# EAGLE schematic ALU (EAGLE 9.6.2)

## Sheet 1 of 3
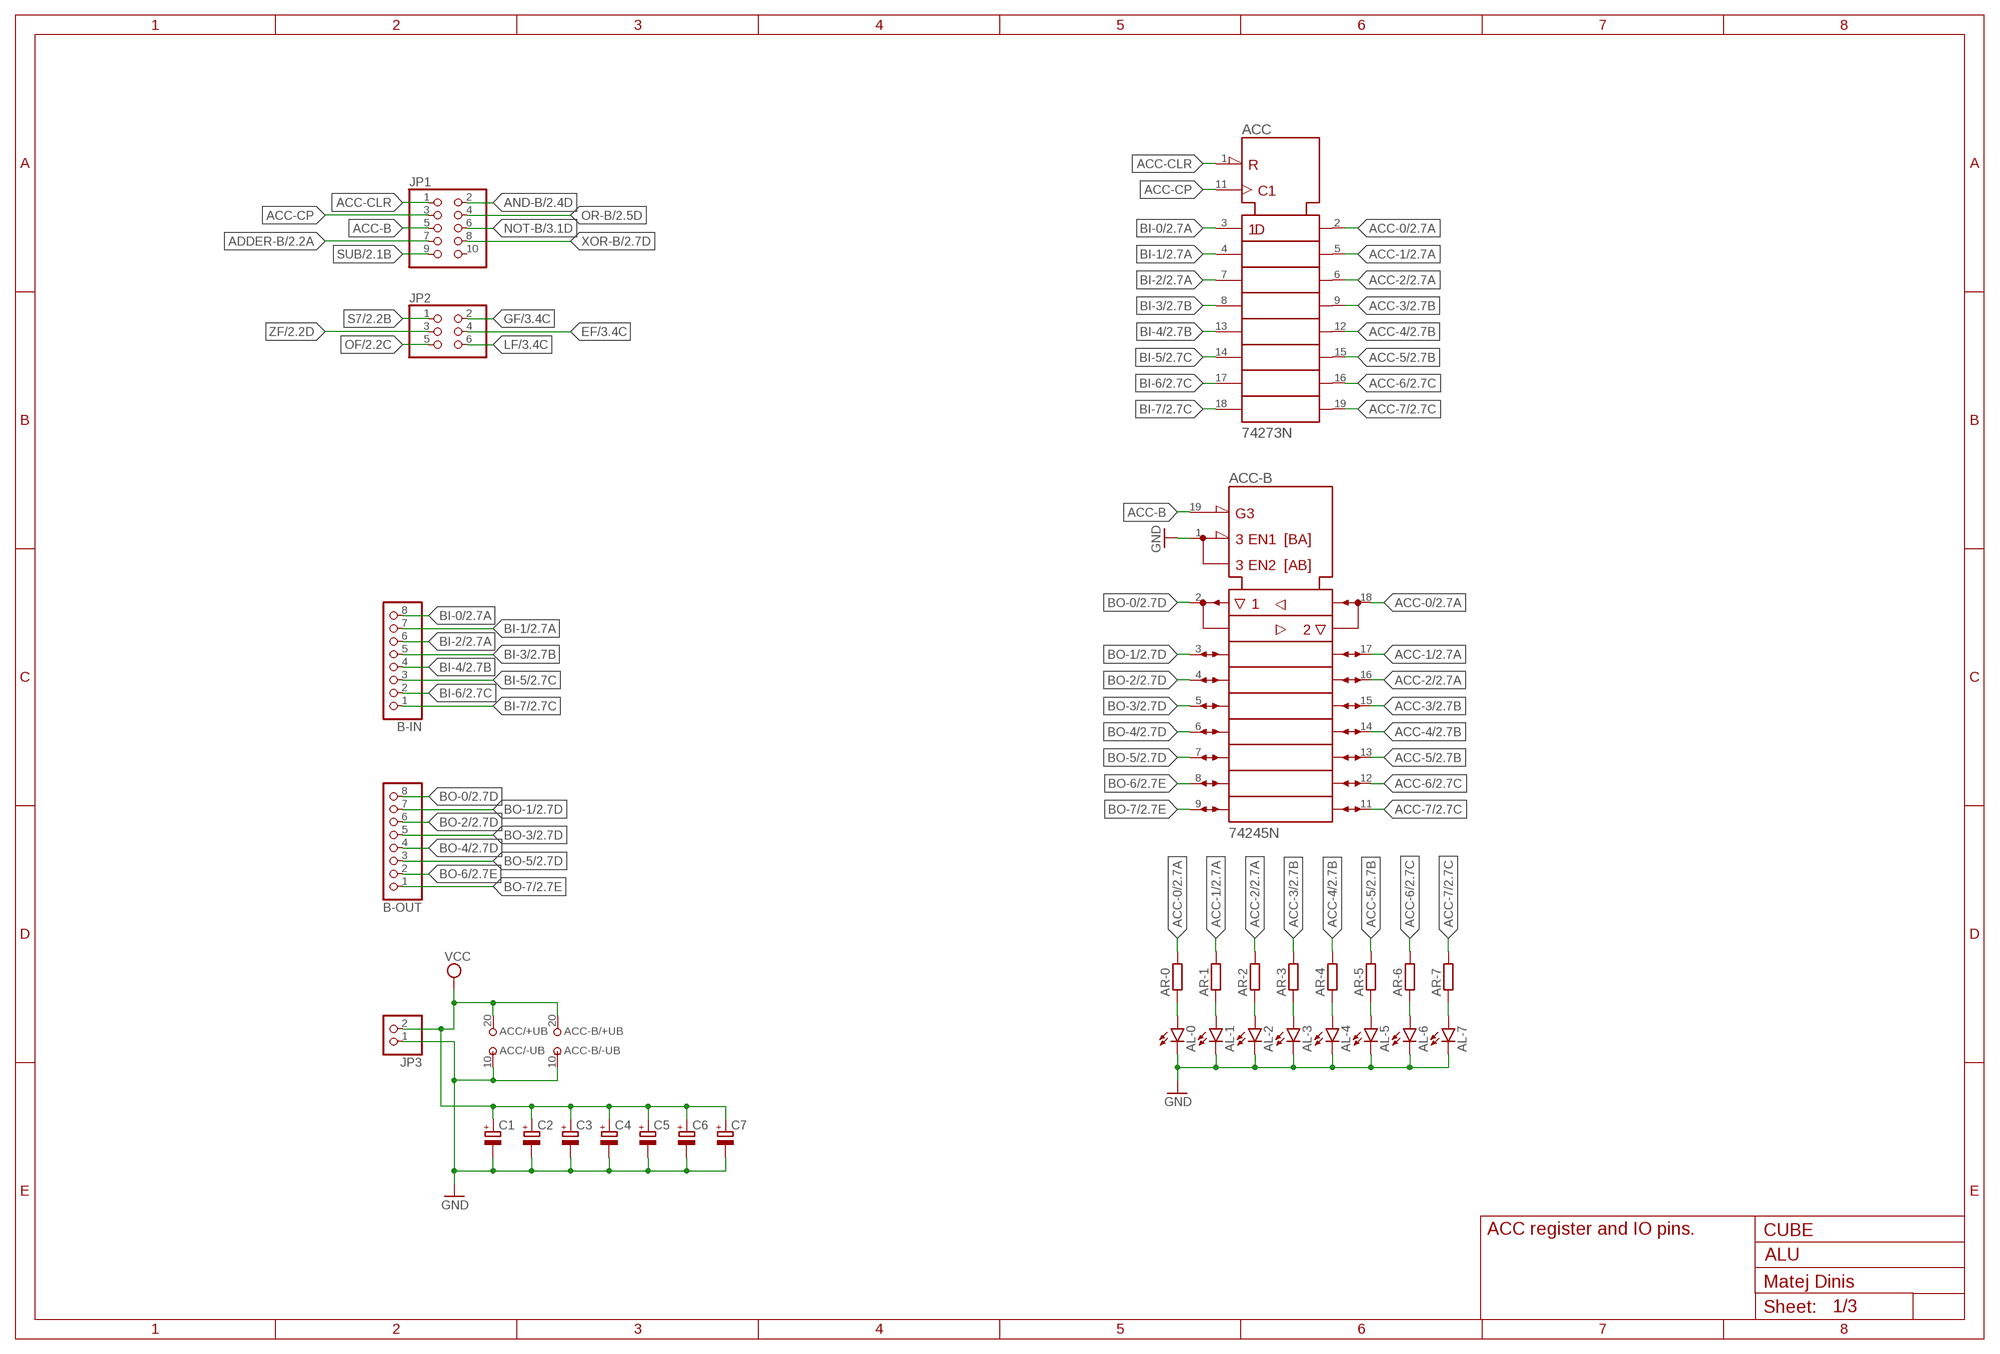
[diagram p0: schematic, sheet 1]

### Parts
ACC  74273N  [DIL20]
ACC-B  74245N  [DIL20]
AL-0  LED5MM  [LED5MM]
AL-1  LED5MM  [LED5MM]
AL-2  LED5MM  [LED5MM]
AL-3  LED5MM  [LED5MM]
AL-4  LED5MM  [LED5MM]
AL-5  LED5MM  [LED5MM]
AL-6  LED5MM  [LED5MM]
AL-7  LED5MM  [LED5MM]
AR-0  R-EU_0207/10  [0207/10]
AR-1  R-EU_0207/10  [0207/10]
AR-2  R-EU_0207/10  [0207/10]
AR-3  R-EU_0207/10  [0207/10]
AR-4  R-EU_0207/10  [0207/10]
AR-5  R-EU_0207/10  [0207/10]
AR-6  R-EU_0207/10  [0207/10]
AR-7  R-EU_0207/10  [0207/10]
B-IN  PINHD-1X8  [1X08]
B-OUT  PINHD-1X8  [1X08]
C1  CPOL-EUE3.5-8  [E3,5-8]
C2  CPOL-EUE3.5-8  [E3,5-8]
C3  CPOL-EUE3.5-8  [E3,5-8]
C4  CPOL-EUE3.5-8  [E3,5-8]
C5  CPOL-EUE3.5-8  [E3,5-8]
C6  CPOL-EUE3.5-8  [E3,5-8]
C7  CPOL-EUE3.5-8  [E3,5-8]
JP1  PINHD-2X5  [2X05]
JP2  PINHD-2X3  [2X03]
JP3  PINHD-1X2  [1X02]

### Nets
ACC-0: ACC-B.18(B1) ACC.2(1Q) AR-0.2 ; also sheet 2,3
ACC-1: ACC-B.17(B2) ACC.5(2Q) AR-1.2 ; also sheet 2,3
ACC-2: ACC-B.16(B3) ACC.6(3Q) AR-2.2 ; also sheet 2,3
ACC-3: ACC-B.15(B4) ACC.9(4Q) AR-3.2 ; also sheet 2,3
ACC-4: ACC-B.14(B5) ACC.12(5Q) AR-4.2 ; also sheet 2,3
ACC-5: ACC-B.13(B6) ACC.15(6Q) AR-5.2 ; also sheet 2,3
ACC-6: ACC-B.12(B7) ACC.16(7Q) AR-6.2 ; also sheet 2,3
ACC-7: ACC-B.11(B8) ACC.19(8Q) AR-7.2 ; also sheet 2,3
ACC-B: ACC-B.19(!G) JP1.5
ACC-CLR: ACC.1(!CLR) JP1.1
ACC-CP: ACC.11(CLK) JP1.3
ADDER-B: JP1.7 ; also sheet 2
AND-B: JP1.2 ; also sheet 2
BI-0: ACC.3(1D) B-IN.8 ; also sheet 2,3
BI-1: ACC.4(2D) B-IN.7 ; also sheet 2,3
BI-2: ACC.7(3D) B-IN.6 ; also sheet 2,3
BI-3: ACC.8(4D) B-IN.5 ; also sheet 2,3
BI-4: ACC.13(5D) B-IN.4 ; also sheet 2,3
BI-5: ACC.14(6D) B-IN.3 ; also sheet 2,3
BI-6: ACC.17(7D) B-IN.2 ; also sheet 2,3
BI-7: ACC.18(8D) B-IN.1 ; also sheet 2,3
BO-0: ACC-B.2(A1) B-OUT.8 ; also sheet 2,3
BO-1: ACC-B.3(A2) B-OUT.7 ; also sheet 2,3
BO-2: ACC-B.4(A3) B-OUT.6 ; also sheet 2,3
BO-3: ACC-B.5(A4) B-OUT.5 ; also sheet 2,3
BO-4: ACC-B.6(A5) B-OUT.4 ; also sheet 2,3
BO-5: ACC-B.7(A6) B-OUT.3 ; also sheet 2,3
BO-6: ACC-B.8(A7) B-OUT.2 ; also sheet 2,3
BO-7: ACC-B.9(A8) B-OUT.1 ; also sheet 2,3
EF: JP2.4 ; also sheet 3
GF: JP2.2 ; also sheet 3
GND: ACC-B.1(DIR) ACC-B.10(-UB) ACC.10(-UB) AL-0.K(C) AL-1.K(C) AL-2.K(C) AL-3.K(C) AL-4.K(C) AL-5.K(C) AL-6.K(C) AL-7.K(C) C1.- C2.- C3.- C4.- C5.- C6.- C7.- JP3.1 ; also sheet 2,3
LF: JP2.6 ; also sheet 3
N$1: AL-0.A AR-0.1
N$4: AL-1.A AR-1.1
N$7: AL-2.A AR-2.1
N$10: AL-3.A AR-3.1
N$13: AL-4.A AR-4.1
N$16: AL-5.A AR-5.1
N$19: AL-6.A AR-6.1
N$22: AL-7.A AR-7.1
NOT-B: JP1.6 ; also sheet 3
OF: JP2.5 ; also sheet 2
OR-B: JP1.4 ; also sheet 2
S7: JP2.1 ; also sheet 2
SUB: JP1.9 ; also sheet 2,3
VCC: ACC-B.20(+UB) ACC.20(+UB) C1.+ C2.+ C3.+ C4.+ C5.+ C6.+ C7.+ JP3.2 ; also sheet 2,3
XOR-B: JP1.8 ; also sheet 2
ZF: JP2.3 ; also sheet 2
Unconnected: JP1.10

### Notes on the sheet
- ACC register and IO pins. | CUBE
- Matej Dinis

## Sheet 2 of 3
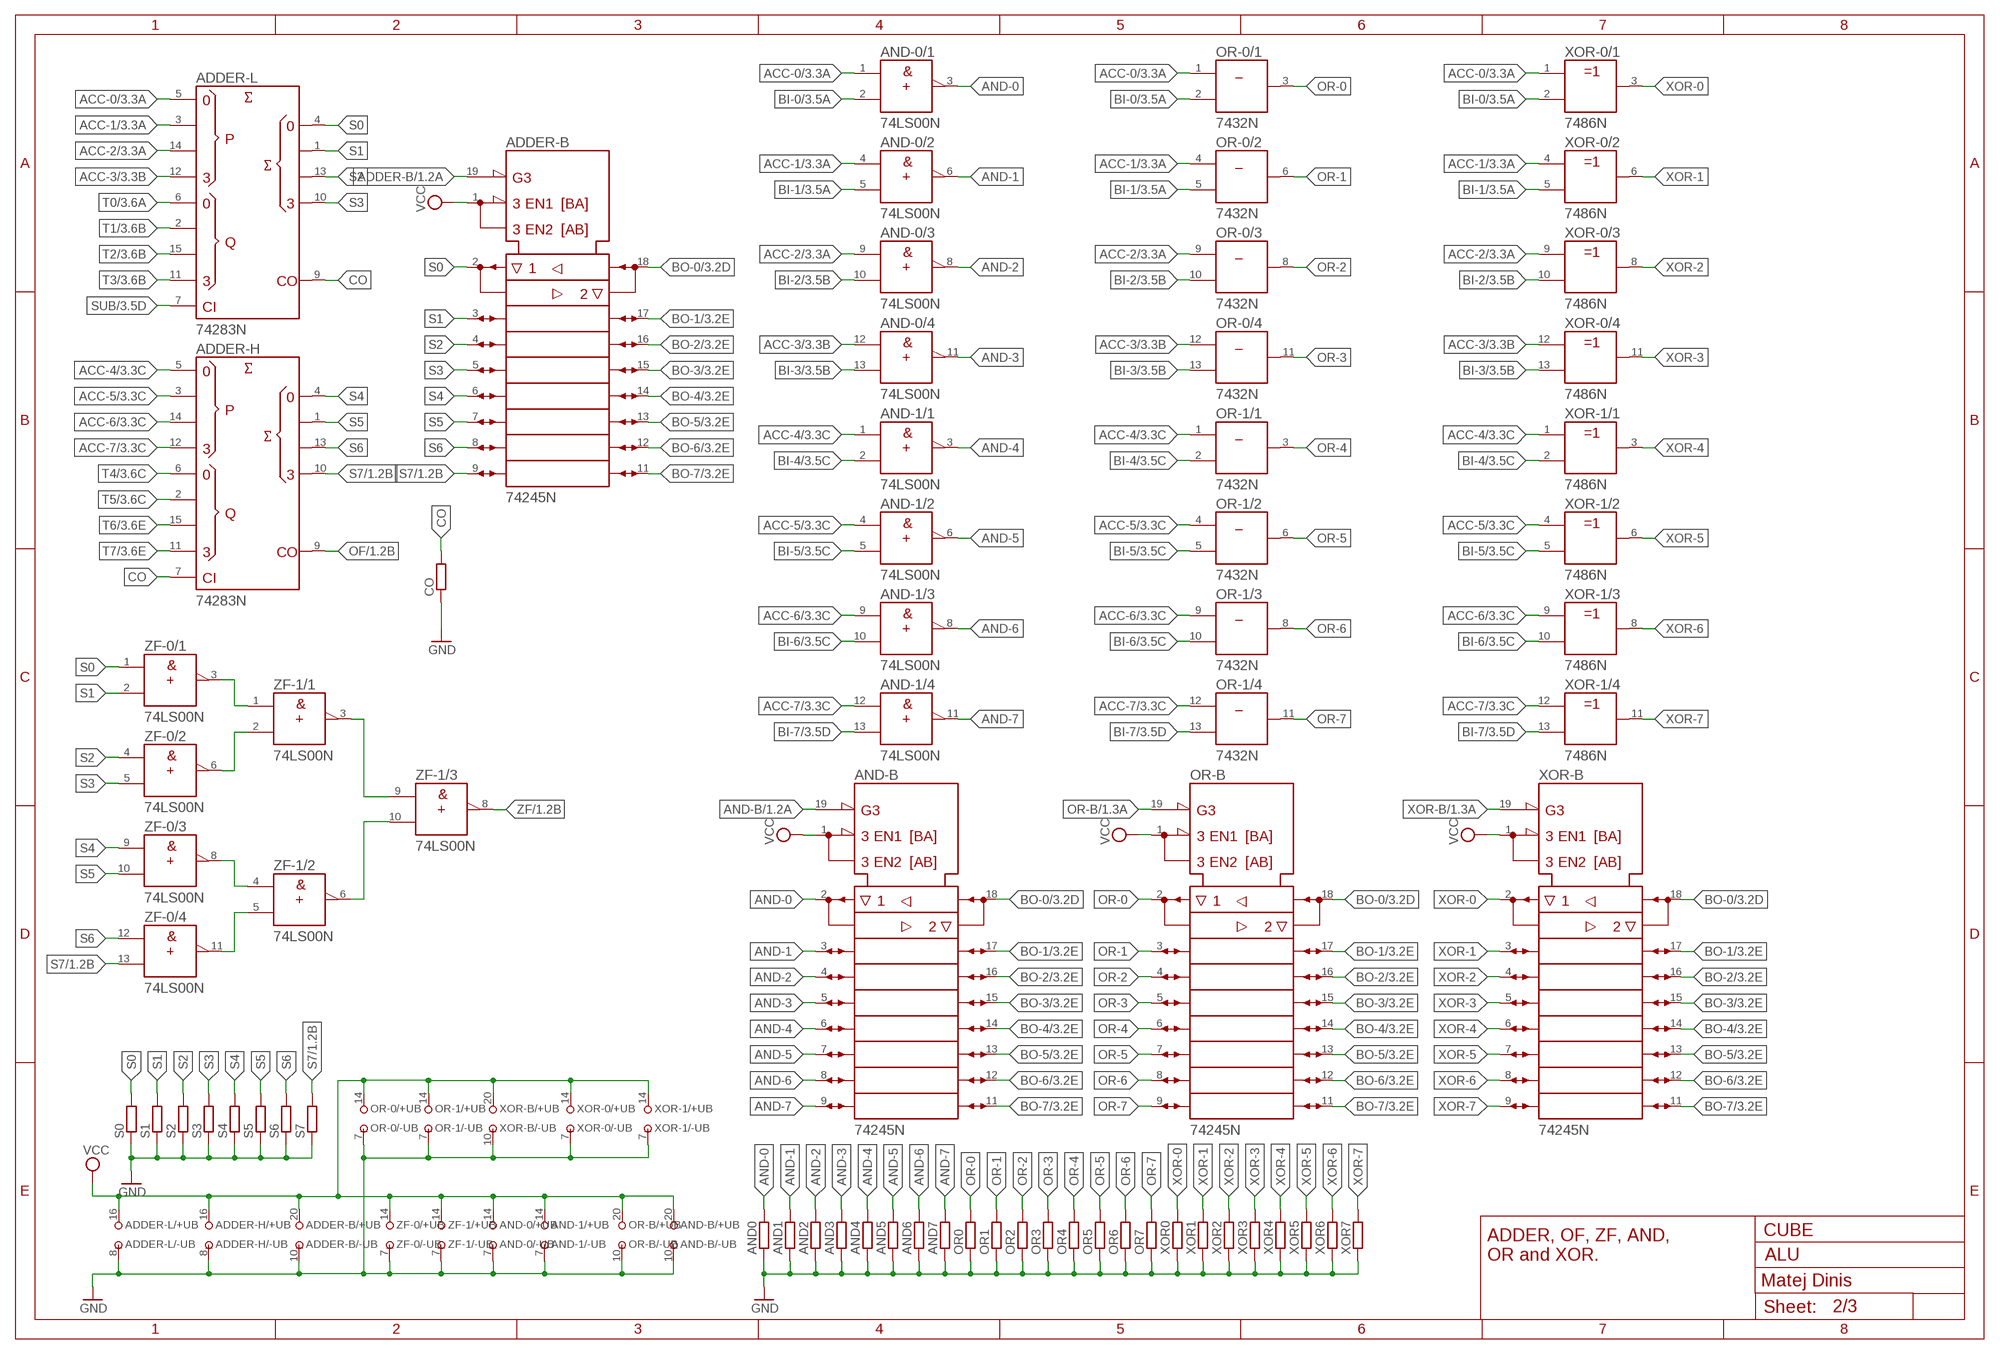
[diagram p1: schematic, sheet 2]

### Parts
ADDER-B  74245N  [DIL20]
ADDER-H  74283N  [DIL16]
ADDER-L  74283N  [DIL16]
AND0  R-EU_0207/10  [0207/10]
AND1  R-EU_0207/10  [0207/10]
AND2  R-EU_0207/10  [0207/10]
AND3  R-EU_0207/10  [0207/10]
AND4  R-EU_0207/10  [0207/10]
AND5  R-EU_0207/10  [0207/10]
AND6  R-EU_0207/10  [0207/10]
AND7  R-EU_0207/10  [0207/10]
AND-0  74LS00N  [DIL14]
AND-1  74LS00N  [DIL14]
AND-B  74245N  [DIL20]
CO  R-EU_0207/10  [0207/10]
OR0  R-EU_0207/10  [0207/10]
OR1  R-EU_0207/10  [0207/10]
OR2  R-EU_0207/10  [0207/10]
OR3  R-EU_0207/10  [0207/10]
OR4  R-EU_0207/10  [0207/10]
OR5  R-EU_0207/10  [0207/10]
OR6  R-EU_0207/10  [0207/10]
OR7  R-EU_0207/10  [0207/10]
OR-0  7432N  [DIL14]
OR-1  7432N  [DIL14]
OR-B  74245N  [DIL20]
S0  R-EU_0207/10  [0207/10]
S1  R-EU_0207/10  [0207/10]
S2  R-EU_0207/10  [0207/10]
S3  R-EU_0207/10  [0207/10]
S4  R-EU_0207/10  [0207/10]
S5  R-EU_0207/10  [0207/10]
S6  R-EU_0207/10  [0207/10]
S7  R-EU_0207/10  [0207/10]
XOR0  R-EU_0207/10  [0207/10]
XOR1  R-EU_0207/10  [0207/10]
XOR2  R-EU_0207/10  [0207/10]
XOR3  R-EU_0207/10  [0207/10]
XOR4  R-EU_0207/10  [0207/10]
XOR5  R-EU_0207/10  [0207/10]
XOR6  R-EU_0207/10  [0207/10]
XOR7  R-EU_0207/10  [0207/10]
XOR-0  7486N  [DIL14]
XOR-1  7486N  [DIL14]
XOR-B  74245N  [DIL20]
ZF-0  74LS00N  [DIL14]
ZF-1  74LS00N  [DIL14]

### Nets
ACC-0: ADDER-L.5(A1) AND-0.1(/1:A) OR-0.1(/1:A) XOR-0.1(/1:A) ; also sheet 1,3
ACC-1: ADDER-L.3(A2) AND-0.4(/2:A) OR-0.4(/2:A) XOR-0.4(/2:A) ; also sheet 1,3
ACC-2: ADDER-L.14(A3) AND-0.9(/3:A) OR-0.9(/3:A) XOR-0.9(/3:A) ; also sheet 1,3
ACC-3: ADDER-L.12(A4) AND-0.12(/4:A) OR-0.12(/4:A) XOR-0.12(/4:A) ; also sheet 1,3
ACC-4: ADDER-H.5(A1) AND-1.1(/1:A) OR-1.1(/1:A) XOR-1.1(/1:A) ; also sheet 1,3
ACC-5: ADDER-H.3(A2) AND-1.4(/2:A) OR-1.4(/2:A) XOR-1.4(/2:A) ; also sheet 1,3
ACC-6: ADDER-H.14(A3) AND-1.9(/3:A) OR-1.9(/3:A) XOR-1.9(/3:A) ; also sheet 1,3
ACC-7: ADDER-H.12(A4) AND-1.12(/4:A) OR-1.12(/4:A) XOR-1.12(/4:A) ; also sheet 1,3
ADDER-B: ADDER-B.19(!G) ; also sheet 1
AND-0: AND0.2 AND-0.3(/1:Y) AND-B.2(A1)
AND-1: AND1.2 AND-0.6(/2:Y) AND-B.3(A2)
AND-2: AND2.2 AND-0.8(/3:Y) AND-B.4(A3)
AND-3: AND3.2 AND-0.11(/4:Y) AND-B.5(A4)
AND-4: AND4.2 AND-1.3(/1:Y) AND-B.6(A5)
AND-5: AND5.2 AND-1.6(/2:Y) AND-B.7(A6)
AND-6: AND6.2 AND-1.8(/3:Y) AND-B.8(A7)
AND-7: AND7.2 AND-1.11(/4:Y) AND-B.9(A8)
AND-B: AND-B.19(!G) ; also sheet 1
BI-0: AND-0.2(/1:B) OR-0.2(/1:B) XOR-0.2(/1:B) ; also sheet 1,3
BI-1: AND-0.5(/2:B) OR-0.5(/2:B) XOR-0.5(/2:B) ; also sheet 1,3
BI-2: AND-0.10(/3:B) OR-0.10(/3:B) XOR-0.10(/3:B) ; also sheet 1,3
BI-3: AND-0.13(/4:B) OR-0.13(/4:B) XOR-0.13(/4:B) ; also sheet 1,3
BI-4: AND-1.2(/1:B) OR-1.2(/1:B) XOR-1.2(/1:B) ; also sheet 1,3
BI-5: AND-1.5(/2:B) OR-1.5(/2:B) XOR-1.5(/2:B) ; also sheet 1,3
BI-6: AND-1.10(/3:B) OR-1.10(/3:B) XOR-1.10(/3:B) ; also sheet 1,3
BI-7: AND-1.13(/4:B) OR-1.13(/4:B) XOR-1.13(/4:B) ; also sheet 1,3
BO-0: ADDER-B.18(B1) AND-B.18(B1) OR-B.18(B1) XOR-B.18(B1) ; also sheet 1,3
BO-1: ADDER-B.17(B2) AND-B.17(B2) OR-B.17(B2) XOR-B.17(B2) ; also sheet 1,3
BO-2: ADDER-B.16(B3) AND-B.16(B3) OR-B.16(B3) XOR-B.16(B3) ; also sheet 1,3
BO-3: ADDER-B.15(B4) AND-B.15(B4) OR-B.15(B4) XOR-B.15(B4) ; also sheet 1,3
BO-4: ADDER-B.14(B5) AND-B.14(B5) OR-B.14(B5) XOR-B.14(B5) ; also sheet 1,3
BO-5: ADDER-B.13(B6) AND-B.13(B6) OR-B.13(B6) XOR-B.13(B6) ; also sheet 1,3
BO-6: ADDER-B.12(B7) AND-B.12(B7) OR-B.12(B7) XOR-B.12(B7) ; also sheet 1,3
BO-7: ADDER-B.11(B8) AND-B.11(B8) OR-B.11(B8) XOR-B.11(B8) ; also sheet 1,3
CO: ADDER-H.7(C0) ADDER-L.9(C4) CO.2
GND: ADDER-B.10(-UB) ADDER-H.8(-UB) ADDER-L.8(-UB) AND0.1 AND1.1 AND2.1 AND3.1 AND4.1 AND5.1 AND6.1 AND7.1 AND-0.7(/-UB:-UB) AND-1.7(/-UB:-UB) AND-B.10(-UB) CO.1 OR0.1 OR1.1 OR2.1 OR3.1 OR4.1 OR5.1 OR6.1 OR7.1 OR-0.7(/-UB:-UB) OR-1.7(/-UB:-UB) OR-B.10(-UB) S0.1 S1.1 S2.1 S3.1 S4.1 S5.1 S6.1 S7.1 XOR0.1 XOR1.1 XOR2.1 XOR3.1 XOR4.1 XOR5.1 XOR6.1 XOR7.1 XOR-0.7(/-UB:-UB) XOR-1.7(/-UB:-UB) XOR-B.10(-UB) ZF-0.7(/-UB:-UB) ZF-1.7(/-UB:-UB) ; also sheet 1,3
N$14: ZF-0.11(/4:Y) ZF-1.5(/2:B)
N$15: ZF-0.8(/3:Y) ZF-1.4(/2:A)
N$17: ZF-0.6(/2:Y) ZF-1.2(/1:B)
N$18: ZF-0.3(/1:Y) ZF-1.1(/1:A)
N$20: ZF-1.3(/1:Y) ZF-1.9(/3:A)
N$21: ZF-1.6(/2:Y) ZF-1.10(/3:B)
OF: ADDER-H.9(C4) ; also sheet 1
OR-0: OR0.2 OR-0.3(/1:Y) OR-B.2(A1)
OR-1: OR1.2 OR-0.6(/2:Y) OR-B.3(A2)
OR-2: OR2.2 OR-0.8(/3:Y) OR-B.4(A3)
OR-3: OR3.2 OR-0.11(/4:Y) OR-B.5(A4)
OR-4: OR4.2 OR-1.3(/1:Y) OR-B.6(A5)
OR-5: OR5.2 OR-1.6(/2:Y) OR-B.7(A6)
OR-6: OR6.2 OR-1.8(/3:Y) OR-B.8(A7)
OR-7: OR7.2 OR-1.11(/4:Y) OR-B.9(A8)
OR-B: OR-B.19(!G) ; also sheet 1
S0: ADDER-B.2(A1) ADDER-L.4(S1) S0.2 ZF-0.1(/1:A)
S1: ADDER-B.3(A2) ADDER-L.1(S2) S1.2 ZF-0.2(/1:B)
S2: ADDER-B.4(A3) ADDER-L.13(S3) S2.2 ZF-0.4(/2:A)
S3: ADDER-B.5(A4) ADDER-L.10(S4) S3.2 ZF-0.5(/2:B)
S4: ADDER-B.6(A5) ADDER-H.4(S1) S4.2 ZF-0.9(/3:A)
S5: ADDER-B.7(A6) ADDER-H.1(S2) S5.2 ZF-0.10(/3:B)
S6: ADDER-B.8(A7) ADDER-H.13(S3) S6.2 ZF-0.12(/4:A)
S7: ADDER-B.9(A8) ADDER-H.10(S4) S7.2 ZF-0.13(/4:B) ; also sheet 1
SUB: ADDER-L.7(C0) ; also sheet 1,3
T0: ADDER-L.6(B1) ; also sheet 3
T1: ADDER-L.2(B2) ; also sheet 3
T2: ADDER-L.15(B3) ; also sheet 3
T3: ADDER-L.11(B4) ; also sheet 3
T4: ADDER-H.6(B1) ; also sheet 3
T5: ADDER-H.2(B2) ; also sheet 3
T6: ADDER-H.15(B3) ; also sheet 3
T7: ADDER-H.11(B4) ; also sheet 3
VCC: ADDER-B.1(DIR) ADDER-B.20(+UB) ADDER-H.16(+UB) ADDER-L.16(+UB) AND-0.14(/+UB:+UB) AND-1.14(/+UB:+UB) AND-B.1(DIR) AND-B.20(+UB) OR-0.14(/+UB:+UB) OR-1.14(/+UB:+UB) OR-B.1(DIR) OR-B.20(+UB) XOR-0.14(/+UB:+UB) XOR-1.14(/+UB:+UB) XOR-B.1(DIR) XOR-B.20(+UB) ZF-0.14(/+UB:+UB) ZF-1.14(/+UB:+UB) ; also sheet 1,3
XOR-0: XOR0.2 XOR-0.3(/1:Y) XOR-B.2(A1)
XOR-1: XOR1.2 XOR-0.6(/2:Y) XOR-B.3(A2)
XOR-2: XOR2.2 XOR-0.8(/3:Y) XOR-B.4(A3)
XOR-3: XOR3.2 XOR-0.11(/4:Y) XOR-B.5(A4)
XOR-4: XOR4.2 XOR-1.3(/1:Y) XOR-B.6(A5)
XOR-5: XOR5.2 XOR-1.6(/2:Y) XOR-B.7(A6)
XOR-6: XOR6.2 XOR-1.8(/3:Y) XOR-B.8(A7)
XOR-7: XOR7.2 XOR-1.11(/4:Y) XOR-B.9(A8)
XOR-B: XOR-B.19(!G) ; also sheet 1
ZF: ZF-1.8(/3:Y) ; also sheet 1
Unconnected: ZF-1.11(/4:Y) ZF-1.12(/4:A) ZF-1.13(/4:B)

### Notes on the sheet
- CUBE
- ADDER, OF, ZF, AND, 
  OR and XOR.
- Matej Dinis

## Sheet 3 of 3
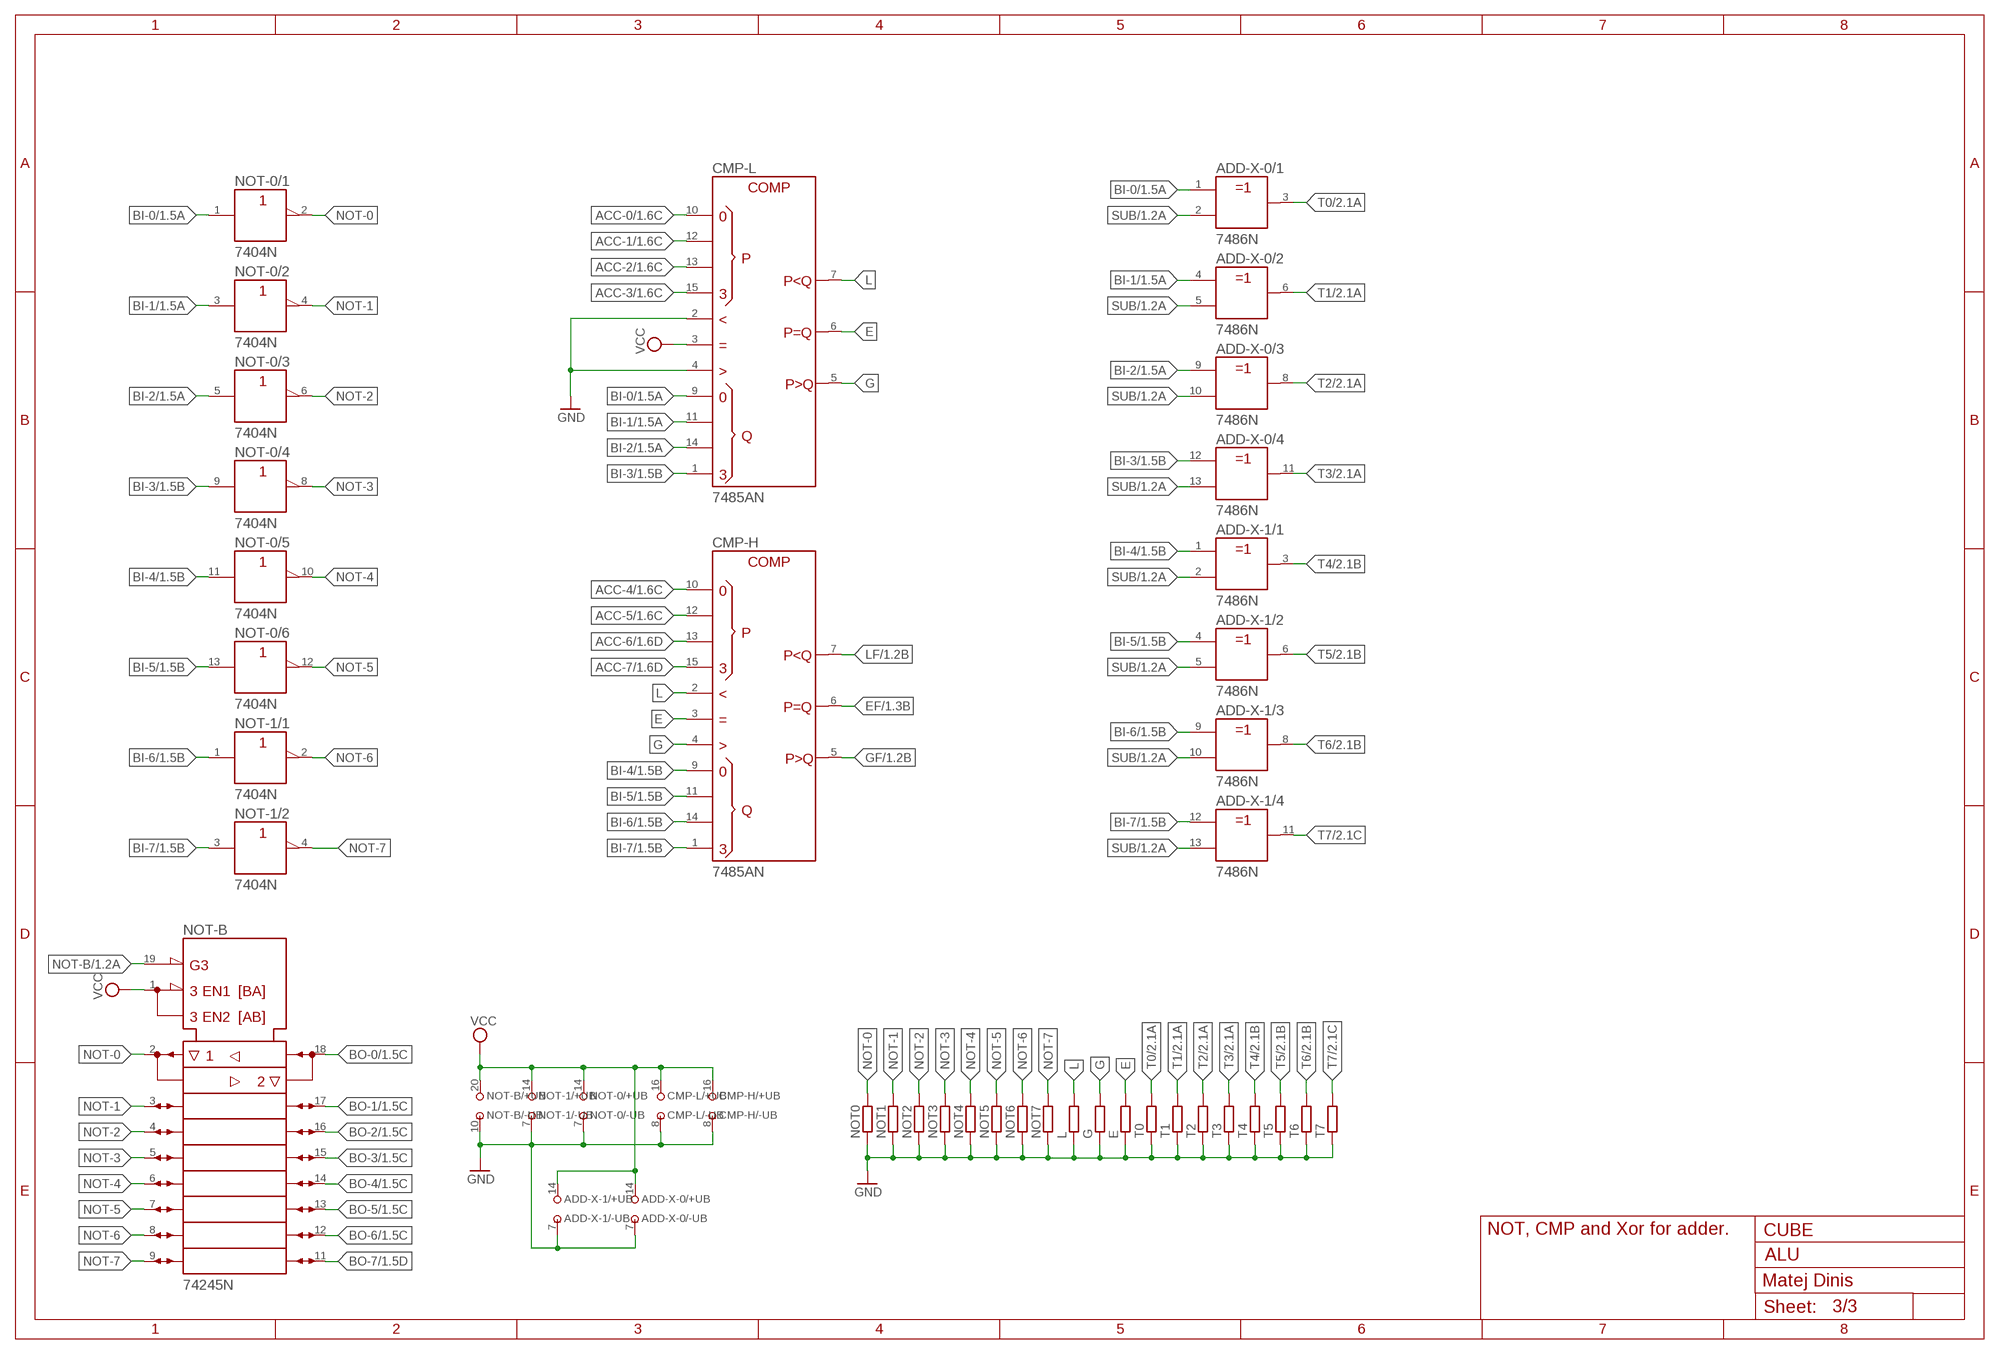
[diagram p2: schematic, sheet 3]

### Parts
ADD-X-0  7486N  [DIL14]
ADD-X-1  7486N  [DIL14]
CMP-H  7485AN  [DIL16]
CMP-L  7485AN  [DIL16]
E  R-EU_0207/10  [0207/10]
G  R-EU_0207/10  [0207/10]
L  R-EU_0207/10  [0207/10]
NOT0  R-EU_0207/10  [0207/10]
NOT1  R-EU_0207/10  [0207/10]
NOT2  R-EU_0207/10  [0207/10]
NOT3  R-EU_0207/10  [0207/10]
NOT4  R-EU_0207/10  [0207/10]
NOT5  R-EU_0207/10  [0207/10]
NOT6  R-EU_0207/10  [0207/10]
NOT7  R-EU_0207/10  [0207/10]
NOT-0  7404N  [DIL14]
NOT-1  7404N  [DIL14]
NOT-B  74245N  [DIL20]
T0  R-EU_0207/10  [0207/10]
T1  R-EU_0207/10  [0207/10]
T2  R-EU_0207/10  [0207/10]
T3  R-EU_0207/10  [0207/10]
T4  R-EU_0207/10  [0207/10]
T5  R-EU_0207/10  [0207/10]
T6  R-EU_0207/10  [0207/10]
T7  R-EU_0207/10  [0207/10]

### Nets
ACC-0: CMP-L.10(P0) ; also sheet 1,2
ACC-1: CMP-L.12(P1) ; also sheet 1,2
ACC-2: CMP-L.13(P2) ; also sheet 1,2
ACC-3: CMP-L.15(P3) ; also sheet 1,2
ACC-4: CMP-H.10(P0) ; also sheet 1,2
ACC-5: CMP-H.12(P1) ; also sheet 1,2
ACC-6: CMP-H.13(P2) ; also sheet 1,2
ACC-7: CMP-H.15(P3) ; also sheet 1,2
BI-0: ADD-X-0.1(/1:A) CMP-L.9(Q0) NOT-0.1(/1:A) ; also sheet 1,2
BI-1: ADD-X-0.4(/2:A) CMP-L.11(Q1) NOT-0.3(/2:A) ; also sheet 1,2
BI-2: ADD-X-0.9(/3:A) CMP-L.14(Q2) NOT-0.5(/3:A) ; also sheet 1,2
BI-3: ADD-X-0.12(/4:A) CMP-L.1(Q3) NOT-0.9(/4:A) ; also sheet 1,2
BI-4: ADD-X-1.1(/1:A) CMP-H.9(Q0) NOT-0.11(/5:A) ; also sheet 1,2
BI-5: ADD-X-1.4(/2:A) CMP-H.11(Q1) NOT-0.13(/6:A) ; also sheet 1,2
BI-6: ADD-X-1.9(/3:A) CMP-H.14(Q2) NOT-1.1(/1:A) ; also sheet 1,2
BI-7: ADD-X-1.12(/4:A) CMP-H.1(Q3) NOT-1.3(/2:A) ; also sheet 1,2
BO-0: NOT-B.18(B1) ; also sheet 1,2
BO-1: NOT-B.17(B2) ; also sheet 1,2
BO-2: NOT-B.16(B3) ; also sheet 1,2
BO-3: NOT-B.15(B4) ; also sheet 1,2
BO-4: NOT-B.14(B5) ; also sheet 1,2
BO-5: NOT-B.13(B6) ; also sheet 1,2
BO-6: NOT-B.12(B7) ; also sheet 1,2
BO-7: NOT-B.11(B8) ; also sheet 1,2
E: CMP-H.3(PEQQ_) CMP-L.6(PEQQ) E.2
EF: CMP-H.6(PEQQ) ; also sheet 1
G: CMP-H.4(PGTQ_) CMP-L.5(PGTQ) G.2
GF: CMP-H.5(PGTQ) ; also sheet 1
GND: ADD-X-0.7(/-UB:-UB) ADD-X-1.7(/-UB:-UB) CMP-H.8(-UB) CMP-L.2(PLTQ_) CMP-L.4(PGTQ_) CMP-L.8(-UB) E.1 G.1 L.1 NOT0.1 NOT1.1 NOT2.1 NOT3.1 NOT4.1 NOT5.1 NOT6.1 NOT7.1 NOT-0.7(/-UB:-UB) NOT-1.7(/-UB:-UB) NOT-B.10(-UB) T0.1 T1.1 T2.1 T3.1 T4.1 T5.1 T6.1 T7.1 ; also sheet 1,2
L: CMP-H.2(PLTQ_) CMP-L.7(PLTQ) L.2
LF: CMP-H.7(PLTQ) ; also sheet 1
NOT-0: NOT0.2 NOT-0.2(/1:Y) NOT-B.2(A1)
NOT-1: NOT1.2 NOT-0.4(/2:Y) NOT-B.3(A2)
NOT-2: NOT2.2 NOT-0.6(/3:Y) NOT-B.4(A3)
NOT-3: NOT3.2 NOT-0.8(/4:Y) NOT-B.5(A4)
NOT-4: NOT4.2 NOT-0.10(/5:Y) NOT-B.6(A5)
NOT-5: NOT5.2 NOT-0.12(/6:Y) NOT-B.7(A6)
NOT-6: NOT6.2 NOT-1.2(/1:Y) NOT-B.8(A7)
NOT-7: NOT7.2 NOT-1.4(/2:Y) NOT-B.9(A8)
NOT-B: NOT-B.19(!G) ; also sheet 1
SUB: ADD-X-0.2(/1:B) ADD-X-0.5(/2:B) ADD-X-0.10(/3:B) ADD-X-0.13(/4:B) ADD-X-1.2(/1:B) ADD-X-1.5(/2:B) ADD-X-1.10(/3:B) ADD-X-1.13(/4:B) ; also sheet 1,2
T0: ADD-X-0.3(/1:Y) T0.2 ; also sheet 2
T1: ADD-X-0.6(/2:Y) T1.2 ; also sheet 2
T2: ADD-X-0.8(/3:Y) T2.2 ; also sheet 2
T3: ADD-X-0.11(/4:Y) T3.2 ; also sheet 2
T4: ADD-X-1.3(/1:Y) T4.2 ; also sheet 2
T5: ADD-X-1.6(/2:Y) T5.2 ; also sheet 2
T6: ADD-X-1.8(/3:Y) T6.2 ; also sheet 2
T7: ADD-X-1.11(/4:Y) T7.2 ; also sheet 2
VCC: ADD-X-0.14(/+UB:+UB) ADD-X-1.14(/+UB:+UB) CMP-H.16(+UB) CMP-L.3(PEQQ_) CMP-L.16(+UB) NOT-0.14(/+UB:+UB) NOT-1.14(/+UB:+UB) NOT-B.1(DIR) NOT-B.20(+UB) ; also sheet 1,2
Unconnected: NOT-1.5(/3:A) NOT-1.6(/3:Y) NOT-1.8(/4:Y) NOT-1.9(/4:A) NOT-1.10(/5:Y) NOT-1.11(/5:A) NOT-1.12(/6:Y) NOT-1.13(/6:A)

### Notes on the sheet
- NOT, CMP and Xor for adder. | CUBE
- Matej Dinis

## Library data of the parts
ACC = 74ttl-din:74*273: Octal D type FLIP FLOP, clear
ACC-B ADDER-B AND-B NOT-B OR-B XOR-B = 74ttl-din:74*245: Octal BUS TRANSCEIVER, 3-state
ADD-X-0 ADD-X-1 XOR-0 XOR-1 = 74ttl-din:74*86: Quad 2-input EXCLUSIV-OR gate
ADDER-H ADDER-L = 74ttl-din:74*283: 4-bit binary FULL ADDER, fast carry
AL-0 AL-1-AL-7 = led:LED: LED OSRAM: - CHIPLED LG R971, LG N971, LY N971, LG Q971, LY Q971, LO R971, LY R971 LH N974, LH R974 LS Q976, LO Q976, LY Q976 LO Q996 - Hyper CHIPLED LW Q18S LB Q993, LB Q99A, LB R99A - SideLED LS A670, LO A670, LY A670, LG A670, LP A670 LB A673, LV A673, LT A673, LW A673 LH A674 LY A675 LS A676, LA A676, LO A676, LY A676, LW A676 LS A679, LY A679, LG A679 - Hyper Micro SIDELED® LS Y876, LA Y876, LO Y876, LY Y876 LT Y87S - SmartLED LW L88C, LW L88S LB L89C, LB L89S, LG L890 LS L89K, LO L89K, LY L89K LS L896, LA L896, LO L896, LY L896 - TOPLED LS T670, LO T670, LY T670, LG T670, LP T670 LSG T670, LSP T670, LSY T670, LOP T670, LYG T670 LG T671, LOG T671, LSG T671 LB T673, LV T673, LT T673, LW T673 LH T674 LS T676, LA T676, LO T676, LY T676, LB T676, LH T676, LSB T676, LW T676 LB T67C, LV T67C, LT T67C, LS T67K, LO T67K, LY T67K, LW E67C LS E67B, LA E67B, LO E67B, LY E67B, LB E67C, LV E67C, LT E67C LW T67C LS T679, LY T679, LG T679 LS T770, LO T770, LY T770, LG T770, LP T770 LB T773, LV T773, LT T773, LW T773 LH T774 LS E675, LA E675, LY E675, LS T675 LS T776, LA T776, LO T776, LY T776, LB T776 LHGB T686 LT T68C, LB T68C - Hyper Mini TOPLED® LB M676 - Mini TOPLED Santana® LG M470 LS M47K, LO M47K, LY M47K Source: http://www.osram.convergy.de LUXEON: - LUMILED® LXK2-PW12-R00, LXK2-PW12-S00, LXK2-PW14-U00, LXK2-PW14-V00 LXK2-PM12-R00, LXK2-PM12-S00, LXK2-PM14-U00 LXK2-PE12-Q00, LXK2-PE12-R00, LXK2-PE12-S00, LXK2-PE14-T00, LXK2-PE14-U00 LXK2-PB12-K00, LXK2-PB12-L00, LXK2-PB12-M00, LXK2-PB14-N00, LXK2-PB14-P00, LXK2-PB14-Q00 LXK2-PR12-L00, LXK2-PR12-M00, LXK2-PR14-Q00, LXK2-PR14-R00 LXK2-PD12-Q00, LXK2-PD12-R00, LXK2-PD12-S00 LXK2-PH12-R00, LXK2-PH12-S00 LXK2-PL12-P00, LXK2-PL12-Q00, LXK2-PL12-R00 Source: www.luxeon.com KINGBRIGHT: KA-3528ASYC Source: www.kingbright.com
AND0 AND1-AND7 AR-0 AR-1-AR-7 CO E G L NOT0 NOT1-NOT7 OR0 OR1-OR7 S0 S1-S7 T0 T1-T7 XOR0 XOR1-XOR7 = rcl:R-EU_: RESISTOR, European symbol; SPICEPREFIX: R
AND-0 AND-1 ZF-0 ZF-1 = 74ttl-din:74*00: Quad 2-input NAND gate
B-IN B-OUT = pinhead:PINHD-1X8: PIN HEADER
C1-C7 = rcl:CPOL-EU: POLARIZED CAPACITOR, European symbol; SPICEPREFIX: C
CMP-H CMP-L = 74ttl-din:74*85A: 4-bit Magnitude COMPARATOR
JP1 = pinhead:PINHD-2X5: PIN HEADER
JP2 = pinhead:PINHD-2X3: PIN HEADER
JP3 = pinhead:PINHD-1X2: PIN HEADER
NOT-0 NOT-1 = 74ttl-din:74*04: Hex INVERTER
OR-0 OR-1 = 74ttl-din:74*32: Quad 2-input OR gate